# EAGLE design psu (EAGLE 9.6.2)
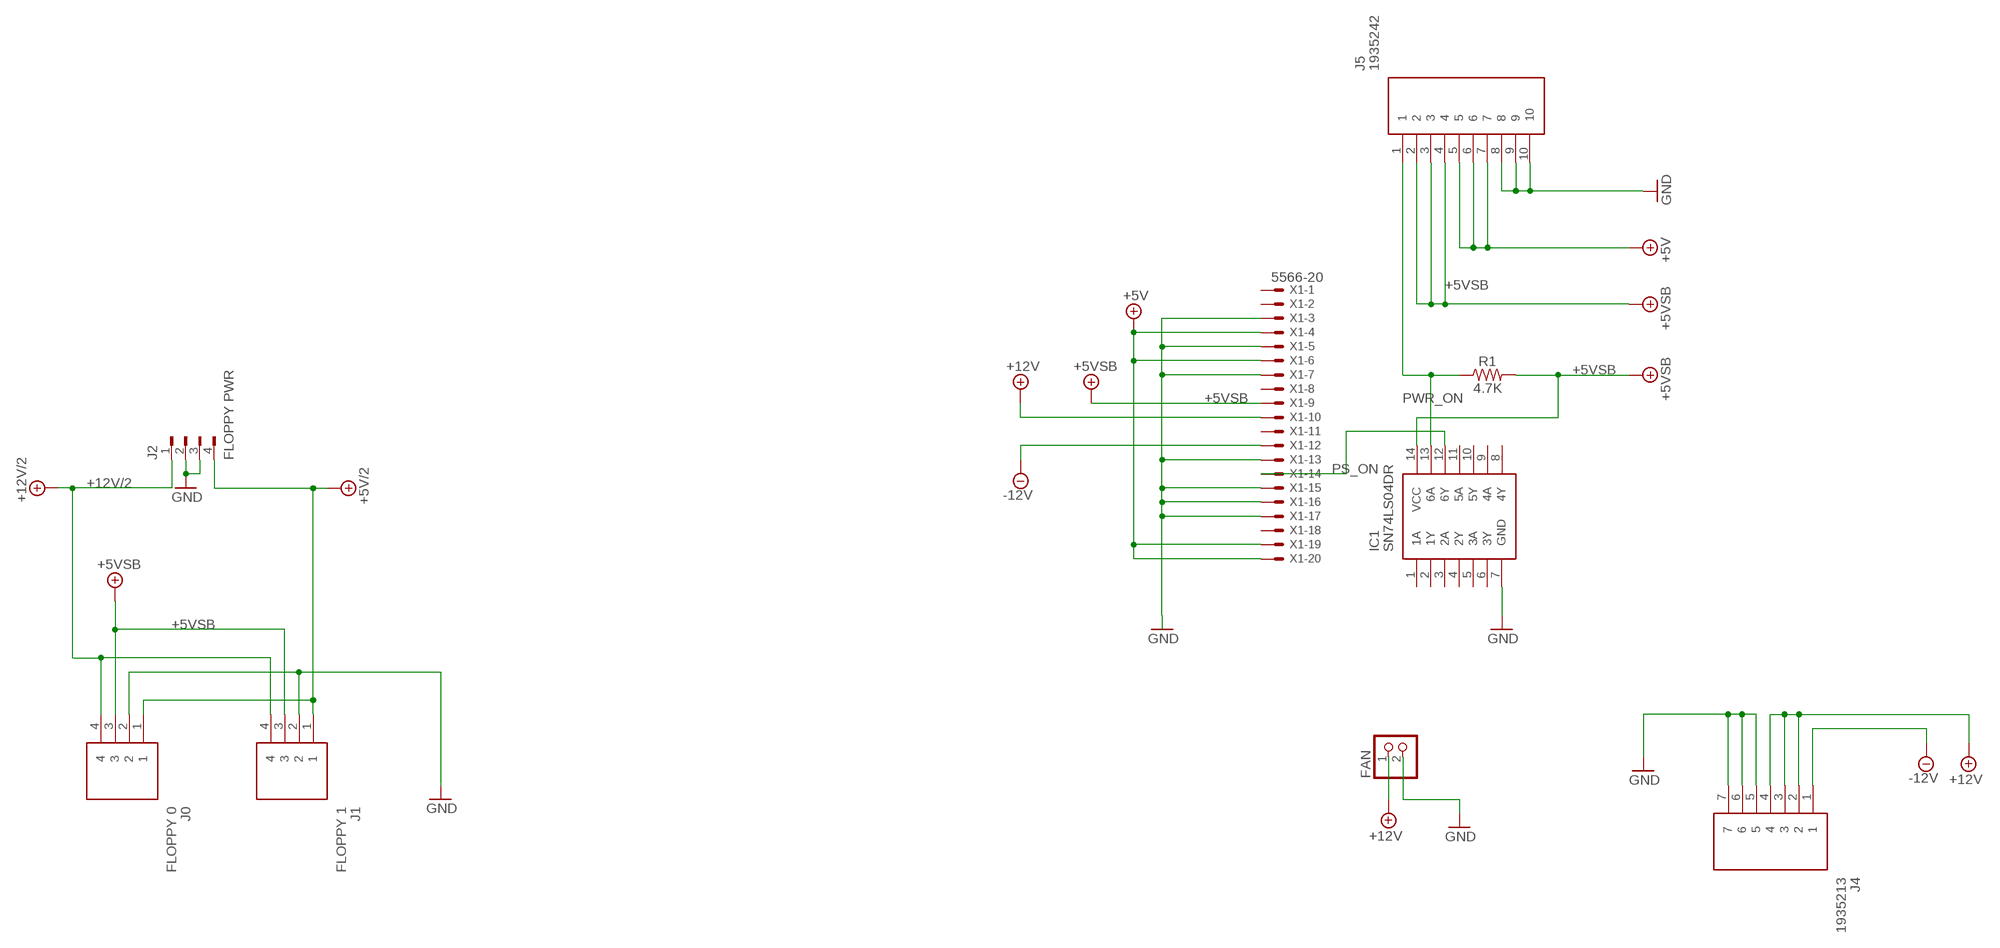
[diagram p0: schematic, sheet 1]

## Parts
FAN  PINHD-1X2  [1X02]
IC1  SN74LS04DR  [SOIC127P600X175-14N]
J0  FLOPPY 0  171825-4  [HDRV4W69P0X250_1X4_1000X500X10]
J1  FLOPPY 1  171825-4  [HDRV4W69P0X250_1X4_1000X500X10]
J2  FLOPPY PWR  FLOPPY-4350211  [350211]
J4  1935213  [1935213]
J5  1935242  [SHDR10W130P0X500_1X10_5000X850]
R1  4.7K  RESISTOR0805  [0805]
X1  5566-20  [5566-20]

## Nets
+5V: J5.5 J5.6 J5.7 X1.4 X1.6 X1.19 X1.20
+5V/2 [12VPWR]: J0.1 J1.1 J2.4
+5VSB [12VPWR]: IC1.14(VCC) J0.3 J1.3 J5.2 J5.3 J5.4 R1.2 X1.9
+12V [12VPWR]: FAN.1 J4.2 J4.3 J4.4 X1.10
+12V/2 [12VPWR]: J0.4 J1.4 J2.1
-12V [12VPWR]: J4.1 X1.12
GND: FAN.2 IC1.7(GND) J0.2 J1.2 J2.2 J2.3 J4.5 J4.6 J4.7 J5.8 J5.9 J5.10 X1.3 X1.5 X1.7 X1.13 X1.15 X1.16 X1.17
PS_ON [SIGNAL]: IC1.12(6Y) X1.14
PWR_ON [SIGNAL]: IC1.13(6A) J5.1 R1.1
Unconnected: IC1.1(1A) IC1.2(1Y) IC1.3(2A) IC1.4(2Y) IC1.5(3A) IC1.6(3Y) IC1.8(4Y) IC1.9(4A) IC1.10(5Y) IC1.11(5A) X1.1 X1.2 X1.8 X1.11 X1.18

## Library data of the parts
FAN = pinhead:PINHD-1X2: PIN HEADER
IC1 = SamacSys_Parts:SN74LS04DR: Hex inverters Source: Datasheet <http://www.ti.com/lit/ds/symlink/sn74ls04.pdf>; DESCRIPTION: Hex inverters; HEIGHT: 1.75mm; MANUFACTURER_NAME: Texas Instruments; MANUFACTURER_PART_NUMBER: SN74LS04DR; MOUSER_PART_NUMBER: 595-SN74LS04DR; MOUSER_PRICE-STOCK: https://www.mouser.co.uk/ProductDetail/Texas-Instruments/SN74LS04DR?qs=SL3LIuy2dWzOhepjTMFpMg%3D%3D
J0 J1 = SamacSys_Parts:171825-4: Header vert 4 way 2.5mm EI Source: Datasheet <http://www.te.com/commerce/DocumentDelivery/DDEController?Action=srchrtrv&DocNm=171825&DocType=Customer Drawing&DocLang=English>; DESCRIPTION: Header vert 4 way 2.5mm EI; HEIGHT: 10.4mm; MANUFACTURER_NAME: TE Connectivity; MANUFACTURER_PART_NUMBER: 171825-4; MOUSER_PART_NUMBER: 571-1718254; MOUSER_PRICE-STOCK: https://www.mouser.co.uk/ProductDetail/TE-Connectivity/171825-4?qs=4hg9R9g9MDuX23iAMtZp8g%3D%3D
J2 = con-amp:FLOPPY-4: MATE N-LOCK Floppy / HDD conector Distributor: Bürklin 71F970
J4 = SamacSys_Parts:1935213: Fixed Terminal Blocks PT 1.5/7-5.0-H Source: Datasheet <https://datasheet.datasheetarchive.com/originals/distributors/SFDatasheet-2/sf-00057464.pdf>; DESCRIPTION: Fixed Terminal Blocks PT 1.5/7-5.0-H; HEIGHT: 11.55mm; MANUFACTURER_NAME: Phoenix Contact; MANUFACTURER_PART_NUMBER: 1935213; MOUSER_PART_NUMBER: 651-1935213; MOUSER_PRICE-STOCK: https://www.mouser.co.uk/ProductDetail/Phoenix-Contact/1935213?qs=wd%252Bw3mUqFrnK4kINj%2Fk1Qg%3D%3D
J5 = SamacSys_Parts:1935242: Phoenix Contact PT 1.5/10-5.0-H PCB Terminal Block, 10 Way/Pole, Screw Terminals, 26 14 AWG Through Hole, Source: Datasheet; DESCRIPTION: Phoenix Contact PT 1.5/10-5.0-H PCB Terminal Block, 10 Way/Pole, Screw Terminals, 26 14 AWG Through Hole,; HEIGHT: 11.4mm; MANUFACTURER_NAME: Phoenix Contact; MANUFACTURER_PART_NUMBER: 1935242; MOUSER_PART_NUMBER: 651-1935242; MOUSER_PRICE-STOCK: https://www.mouser.co.uk/ProductDetail/Phoenix-Contact/1935242?qs=DAHzmYU9cu0ldFZvOUkKdw%3D%3D
R1 = SparkFun-Resistors:RESISTOR: Generic Resistor Package
X1 = con-molex:5566-20: Mini FIT connector 20 pol ATX PC-Motherboard Power connector Source: http://www.molex.com; MF: MOLEX; OC_FARNELL: unknown; OC_NEWARK: unknown

## Net classes
1 12VPWR: width 1.143 mm, clearance 0.076 mm
2 SIGNAL: width 0.178 mm, clearance 0.076 mm

## Board
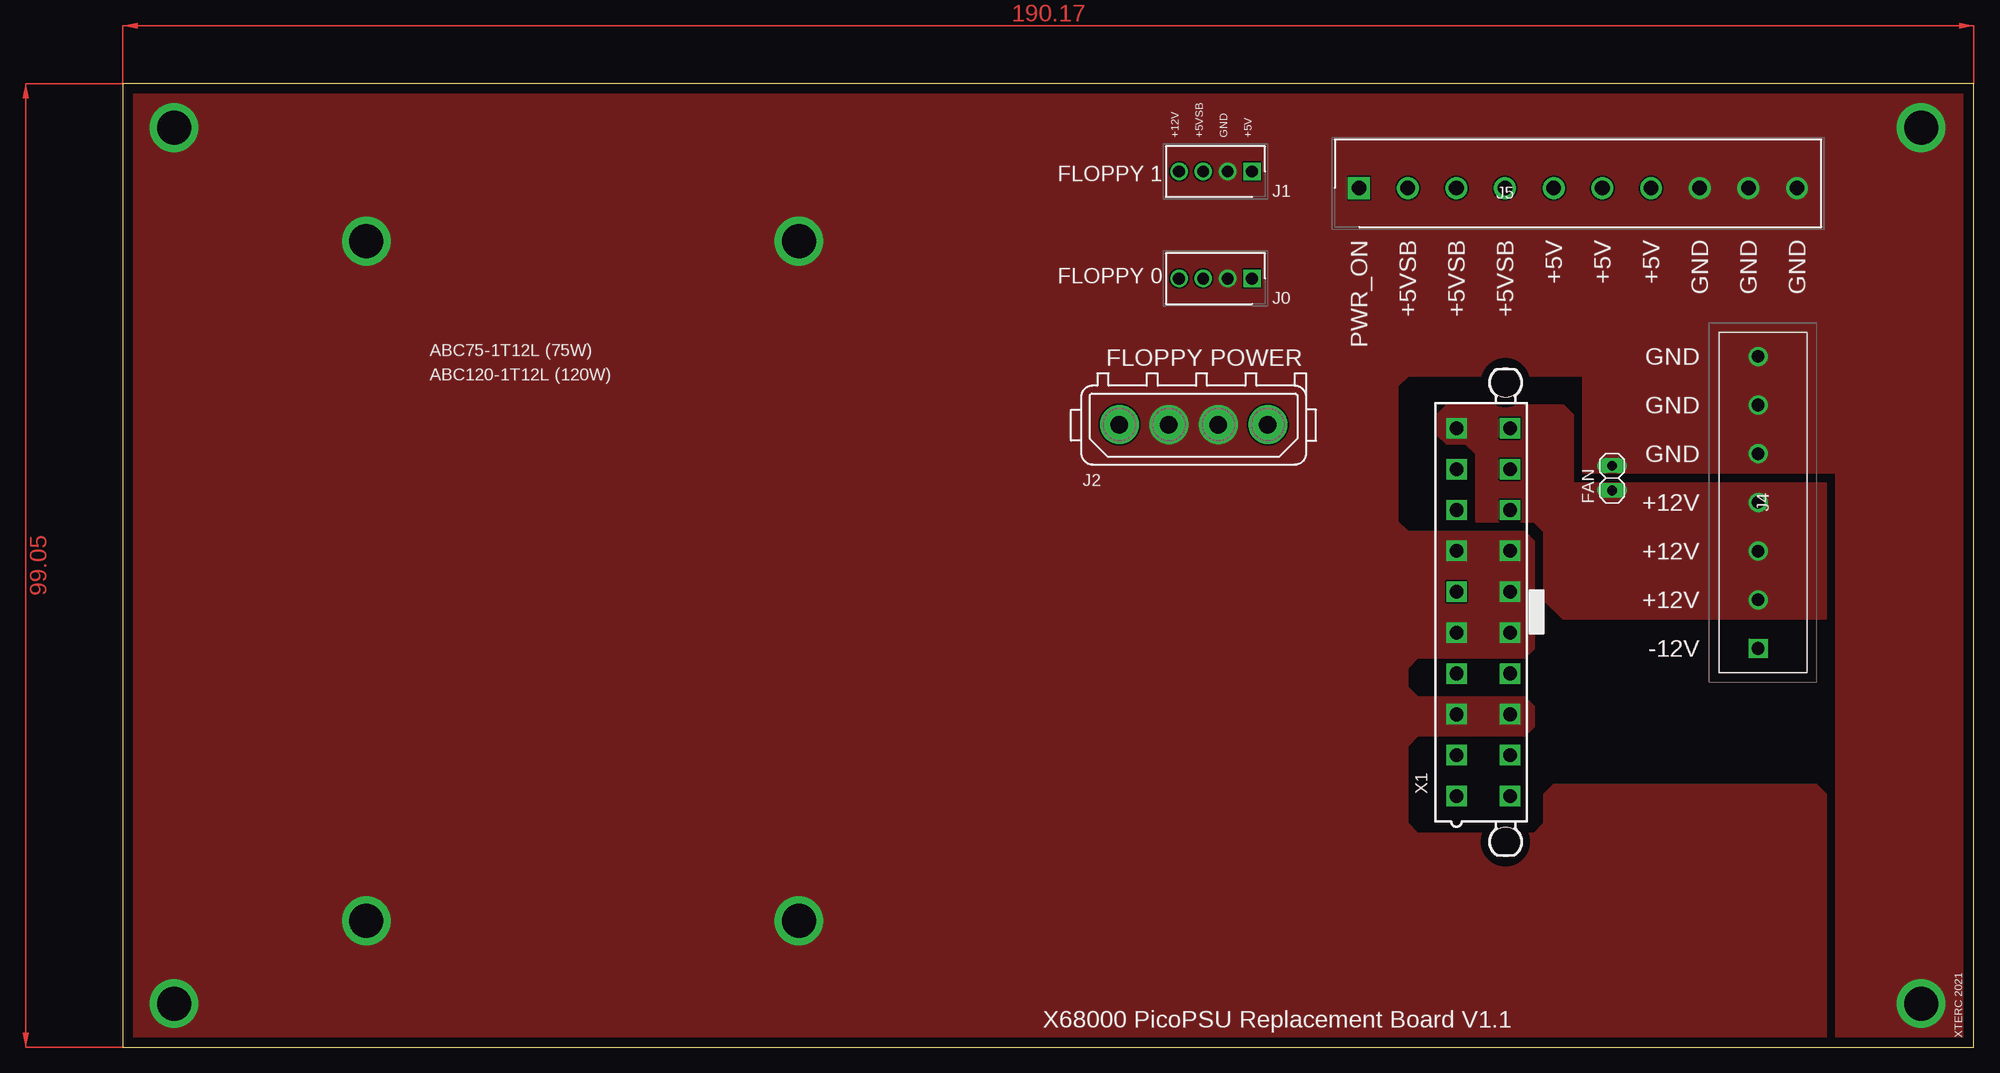
[diagram p1: board, top side]
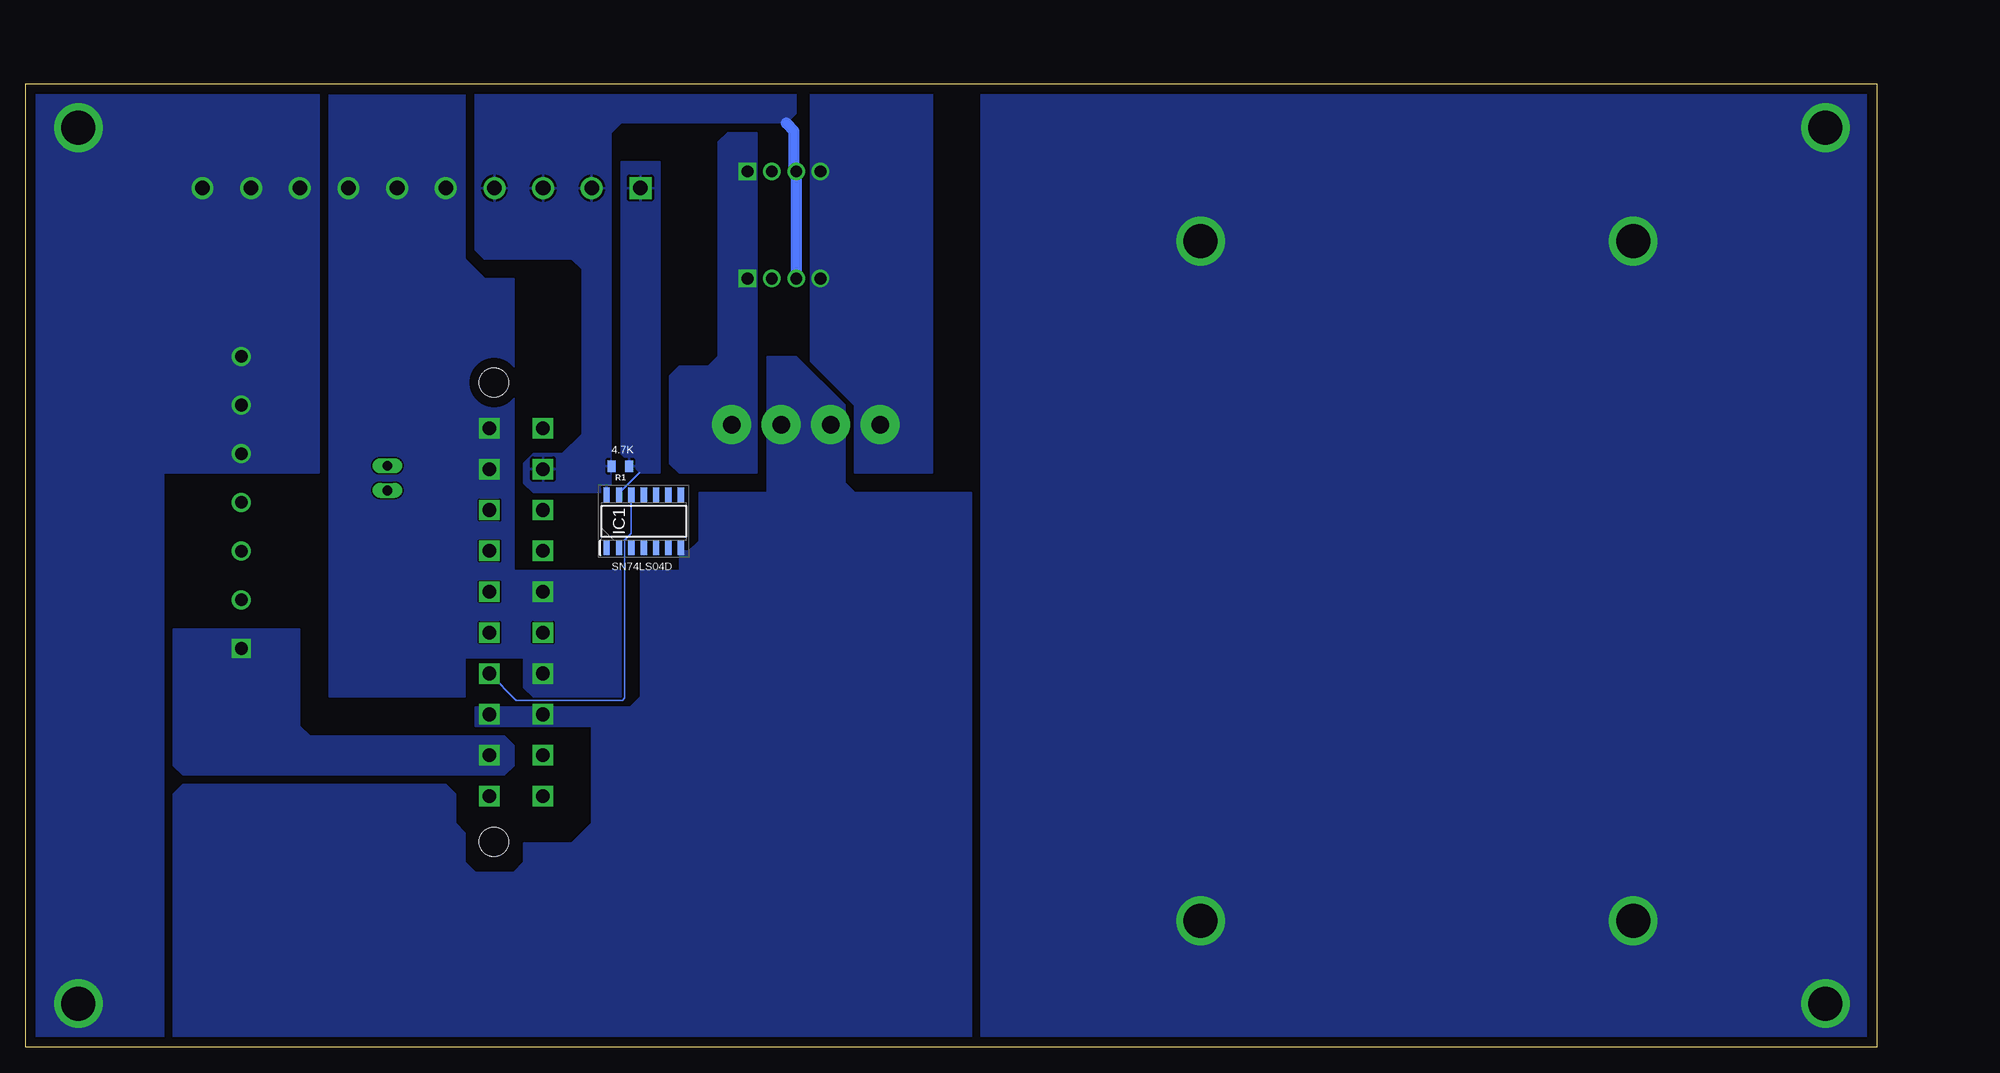
[diagram p2: board, bottom side, seen from below]

Size 190.17 x 99.05 mm. Coordinates in mm from the lower left corner, seen from the top.
Outline: 0,0 190.17,0 190.17,99.05 0,99.05 0,0
Copper layers (1*16): Top 0.035mm / dielectric 1.5mm / Bottom 0.035mm
Design rules "default *": minimum track width 6mil, minimum drill 0.35mm, track to track 6mil, track to pad 6mil, pad to pad 6mil, via to via 6mil, smd to smd 6mil, copper to edge 40mil, drill to drill 6mil, minimum pad ring 10mil, minimum via ring 8mil, stop-mask expansion 4mil, vias tented up to drill 0mil, thermal gap 10mil

### Footprints (pad centres in the part's own frame; a part is rotated, then mirrored left to right if it is on the bottom)
1X02 = drill 1.016 long: 1 -1.27,0; 2 1.27,0
SOIC127P600X175-14N = smd 1.525 x 0.65: 1 -2.712,3.81; 2 -2.712,2.54; 3 -2.712,1.27; 4 -2.712,0; 5 -2.712,-1.27; 6 -2.712,-2.54; 7 -2.712,-3.81; 8 2.712,-3.81; 9 2.712,-2.54; 10 2.712,-1.27; 11 2.712,0; 12 2.712,1.27; 13 2.712,2.54; 14 2.712,3.81
HDRV4W69P0X250_1X4_1000X500X10 = drill 1.2 pad 1.8 square: 1 0,0 | drill 1.2 pad 1.8: 2 2.5,0; 3 5,0; 4 7.5,0
350211 = drill 1.8 pad 4: 1 -7.62,0; 2 -2.54,0; 3 2.54,0; 4 7.62,0
1935213 = drill 1.3 pad 1.95 square: 1 0,0 | drill 1.3 pad 1.95: 2 5,0; 3 10,0; 4 15,0; 5 20,0; 6 25,0; 7 30,0
SHDR10W130P0X500_1X10_5000X850 = drill 1.5 pad 2.25 square: 1 0,0 | drill 1.5 pad 2.25: 2 5,0; 3 10,0; 4 15,0; 5 20,0; 6 25,0; 7 30,0; 8 35,0; 9 40,0; 10 45,0
0805 = smd 0.8 x 1.2: 1 -0.9,0; 2 0.9,0
5566-20 = drill 1.4 square: 1 18.9,-2.75; 2 14.7,-2.75; 3 10.5,-2.75; 4 6.3,-2.75; 5 2.1,-2.75; 6 -2.1,-2.75; 7 -6.3,-2.75; 8 -10.5,-2.75; 9 -14.7,-2.75; 10 -18.9,-2.75; 11 18.9,2.75; 12 14.7,2.75; 13 10.5,2.75; 14 6.3,2.75; 15 2.1,2.75; 16 -2.1,2.75; 17 -6.3,2.75; 18 -10.5,2.75; 19 -14.7,2.75; 20 -18.9,2.75 | hole 3: 23.6,2.29; -23.6,2.29

### Placement (x,y rotation side)
FAN  153,58.5 90 top
IC1  126.66,54.06 90 bottom
J0  116,79 180 top
J1  116,90 180 top
J2  110,64 0 top
J4  168,41 90 top
J5  127,88.3 0 top
R1  129.06,59.72 180 bottom
X1  139.76,44.72 270 top

### Tracks (layer width: path | path; a pad name or v marks a point on that pad's centre or on a via)
+5V
  pour Bottom (no thermals): 129,36 138,36 139,37 139,40 145,40 145,36 159,36 159,98 145,98 145,81 143,79 140,79 140,49 129,49
+5V/2
  pour Bottom (no thermals): 115,59 115,94 118,94 119,93 119,71 120,70 123,70 124,69 124,60 123,59
+5VSB
  Bottom 1.143: J0.3 111.02,79.02 111.02,89.99 J1.3 111.25,90.53 111.25,94.18 112.01,94.94 112.01,95
  pour Bottom: 111,100 144,100 144,82 143,81 134,81 133,80 133,63 135,61 138,61 139,60 139,58 138,57 130,57 130,94 129,95 112,95 111,96
+12V
  pour Top (no thermals): 149,58 175,58 175,44 148,44 146,46 146,53 145,54 139,54 139,61 138,62 136,62 135,63 135,65 136,66 148,66 149,65
+12V/2
  pour Bottom (no thermals): 109.5,100 109.5,70.5 105,66 105,59 97,59 97,100
-12V
  pour Bottom (no thermals): 175,43 162,43 162,33 161,32 141,32 140,31 140,29 141,28 174,28 175,29
GND  (via drill 3.5 pad 5)
  other vias: 184.75,94.5 69.45,82.85 25,82.85 25,13 69.45,13 5.25,4.5 5.25,94.5 184.75,4.5
  pour Top (no thermals): -1,100 191,100 191,-1 176,-1 176,59 150,59 150,69 132,69 131,68 131,54 132,53 144,53 145,52 145,41 144,40 133,40 132,39 132,37 133,36 144,36 145,35 145,33 144,32 133,32 132,31 132,23 133,22 145,22 146,23 146,26 147,27 174,27 175,26 175,-1 -1,-1
  pour Bottom: -1,100 92,100 92,-1 -1,-1 -1,99
  pour Bottom (no thermals): 160,103 160,59 176,59 176,-2 178,-4 196,-4 196,103 195,104 161,104
  pour Top: 97,57 105,57 106,58 106,66 111,71 111,92 113,92 113,58 114,57 121,57 121,52 122,51 123,51 123,49 127,49 127,18 174,18 174,2 94,2 94,57
  pour Bottom (no thermals): 105,57 106,58 106,66 111,71 114,71 114,57 121,57 121,52 122,51 123,51 123,49 127,49 127,36 128,35 144,35 144,33 132,33 132,23 134,21 139,21 139,19 140,18 144,18 145,19 145,22 146,23 146,26 147,27 174,27 175,26 175,1 93,1 93,57
PS_ON
  Bottom 0.178: IC1.12 127.94,52.81 128.63,52.12 128.63,35.89 128.85,35.66 139.75,35.66 142.49,38.41 X1.14
PWR_ON
  Bottom 0.178: 127.08,59.08 129.16,57 129.16,56.84 IC1.13
  pour Bottom: 125,91 129,91 129,61 127,59 126,59 125,59
(copper drawn outside any net)
  shapes: Top area x2

### Text on the board
tNames: +5V | +12V | +5VSB | GND | +5V | FLOPPY 1 | PWR_ON | +5VSB | +5VSB | +5VSB | +5V | +5V | +5V | GND | GND | GND | FLOPPY 0 | ABC75-1T12L (75W) | GND | FLOPPY POWER | ABC120-1T12L (120W) | GND | GND | +12V | +12V | +12V | -12V | X68000 PicoPSU Replacement Board V1.1 | XTERC 2021
bNames: 4.7K | SN74LS04D